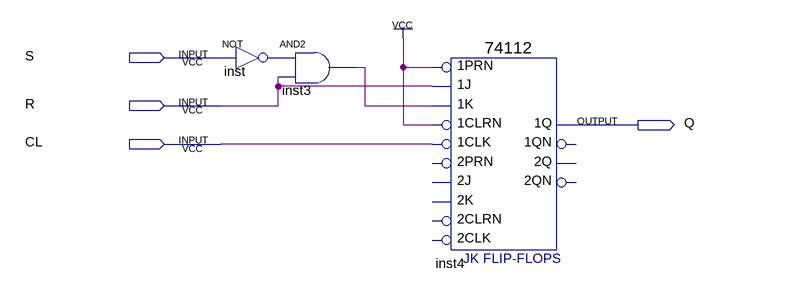
[diagram p0: schematic sheet]
// Quartus schematic problem4.bdf as structural Verilog: 3 symbols, 4 pins
module problem4 (
  input  S,
  input  R,
  input  CL,
  output Q
);

  wire inst3_out, inst_out;

  not inst (inst_out, S);
  and inst3 (inst3_out, inst_out, R);
  \74112  inst4 (
    .\1K (inst3_out), .\1J (R), .\1PRN (1'b1), .\1CLK (CL), .\1CLRN (1'b1), .\1Q (Q));  // open: 2K, 2J, 2PRN, 2CLK, 2CLRN, 1QN, 2Q, 2QN
endmodule
